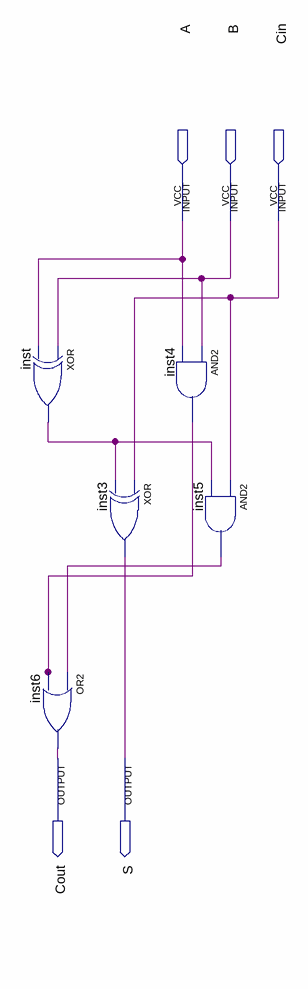
[diagram p0: schematic sheet]
// Quartus schematic fulladder.bdf as structural Verilog: 5 symbols, 5 pins
module fulladder (
  input  A,
  input  B,
  input  Cin,
  output Cout,
  output S
);

  wire inst4_out, inst5_out, inst_out;

  xor inst (inst_out, B, A);
  or inst6 (Cout, inst5_out, inst4_out);
  xor inst3 (S, Cin, inst_out);
  and inst4 (inst4_out, B, A);
  and inst5 (inst5_out, Cin, inst_out);
endmodule
